# EAGLE design Damian_Edition (EAGLE 6.5.0)
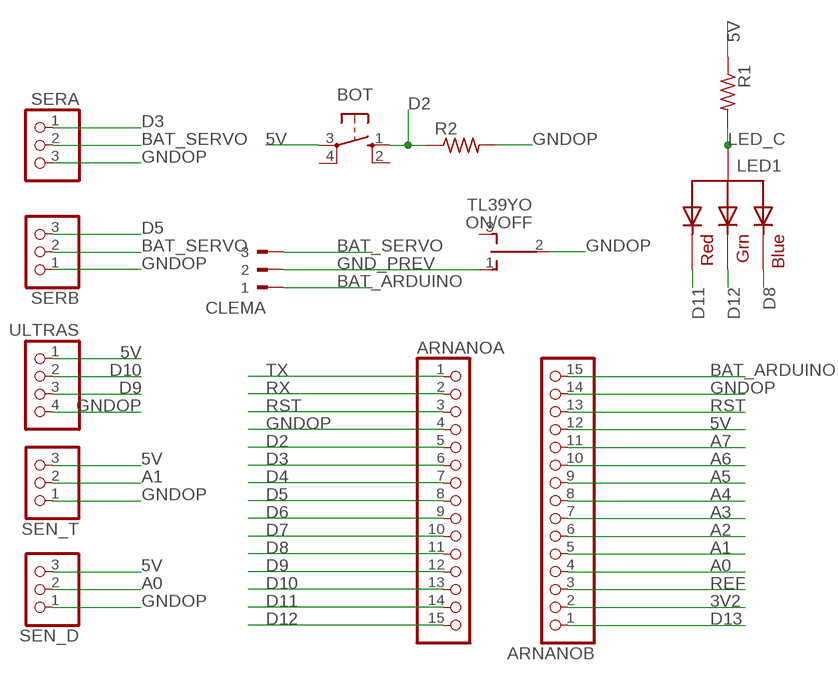
[diagram p0: schematic, sheet 1]

## Parts
ARNANOA  PINHD-1X15  [1X15]
ARNANOB  PINHD-1X15  [1X15]
BOT  10-XX  [B3F-10XX]
CLEMA  90-3  [90-3]
LED1  RGBLED_CA-5MM  [LED5MMRGB]
ON/OFF  TL39YO  [TL3XYO]
R1  R-US_0207/2V  [0207/2V]
R2  R-US_0207/2V  [0207/2V]
SEN_D  PINHD-1X3  [1X03]
SEN_T  PINHD-1X3  [1X03]
SERA  PINHD-1X3  [1X03]
SERB  PINHD-1X3  [1X03]
ULTRAS  PINHD-1X4  [1X04]

## Nets
3V2: ARNANOB.2
5V: ARNANOB.12 BOT.3(P) R1.1 SEN_D.3 SEN_T.3 ULTRAS.1
A0: ARNANOB.4 SEN_D.2
A1: ARNANOB.5 SEN_T.2
A2: ARNANOB.6
A3: ARNANOB.7
A4: ARNANOB.8
A5: ARNANOB.9
A6: ARNANOB.10
A7: ARNANOB.11
BAT_ARDUINO: ARNANOB.15 CLEMA.1
BAT_SERVO: CLEMA.3 SERA.2 SERB.2
D2: ARNANOA.5 BOT.1(S) R2.1
D3: ARNANOA.6 SERA.1
D4: ARNANOA.7
D5: ARNANOA.8 SERB.3
D6: ARNANOA.9
D7: ARNANOA.10
D8: ARNANOA.11 LED1.4(BLUE)
D9: ARNANOA.12 ULTRAS.3
D10: ARNANOA.13 ULTRAS.2
D11: ARNANOA.14 LED1.1(RED)
D12: ARNANOA.15 LED1.3(GREEN)
D13: ARNANOB.1
GND_PREV: CLEMA.2 ON/OFF.1(O)
GNDOP: ARNANOA.4 ARNANOB.14 ON/OFF.2(P) R2.2 SEN_D.1 SEN_T.1 SERA.3 SERB.1 ULTRAS.4
LED_C: LED1.2(VCC) R1.2
REF: ARNANOB.3
RST: ARNANOA.3 ARNANOB.13
RX: ARNANOA.2
TX: ARNANOA.1
Unconnected: BOT.2(S1) BOT.4(P1) ON/OFF.3(S)

## Library data of the parts
ARNANOA ARNANOB = pinhead:PINHD-1X15: PIN HEADER
BOT = switch-omron:10-XX: OMRON SWITCH; MPN: B3F-1000; OC_FARNELL: 176432; OC_NEWARK: 36M3542
CLEMA = con-weidmueller-sl35:90-3: WEIDMUELLER CLAMP CONNECTOR; OC_FARNELL: unknown; OC_NEWARK: unknown
LED1 = adafruit:RGBLED_CA: RGB LED, common-anode 5MM Staggered pins 5mm Piranha package http://www.ladyada.net/library/pcb/eaglelibrary.html
ON/OFF = switch:TL39YO: TINY SWITCH ON OFF ON Source: http://www2.produktinfo.conrad.com/datenblaetter/700000-724999/705152-da-01-de-Subminiaturschalter_TL_36YO.pdf
R1 R2 = adafruit:R-US_: RESISTOR, American symbol
SEN_D SEN_T SERA SERB = pinhead:PINHD-1X3: PIN HEADER
ULTRAS = pinhead:PINHD-1X4: PIN HEADER

## Board
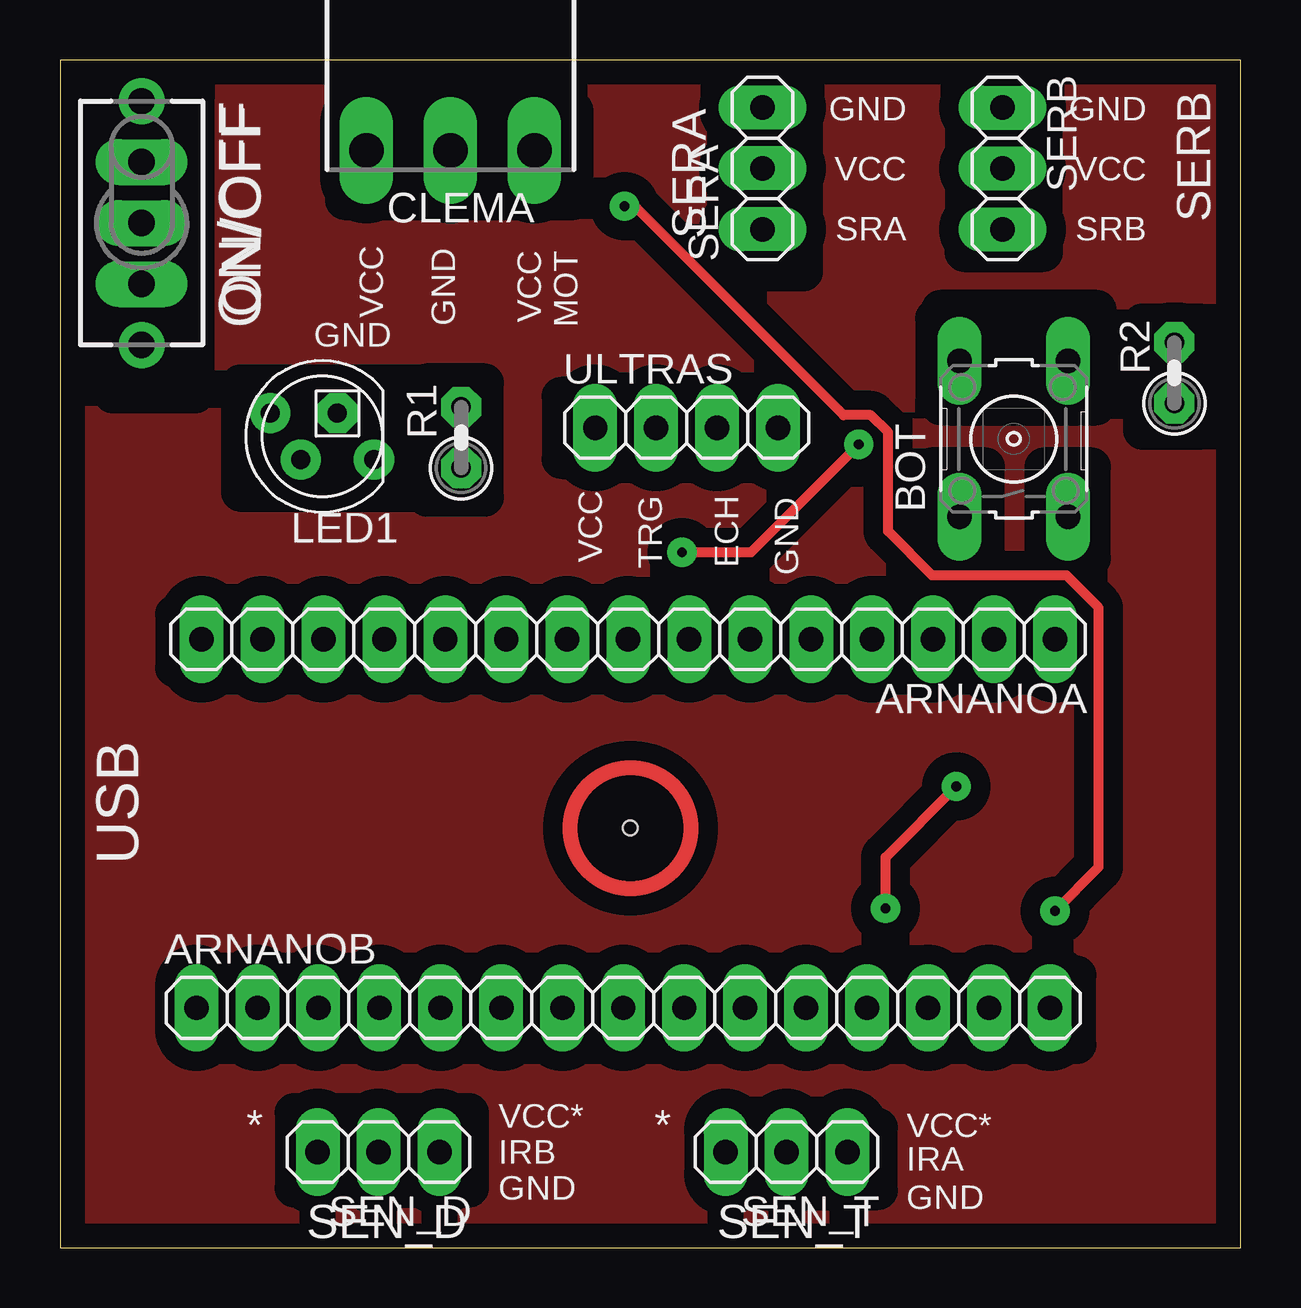
[diagram p1: board, top side]
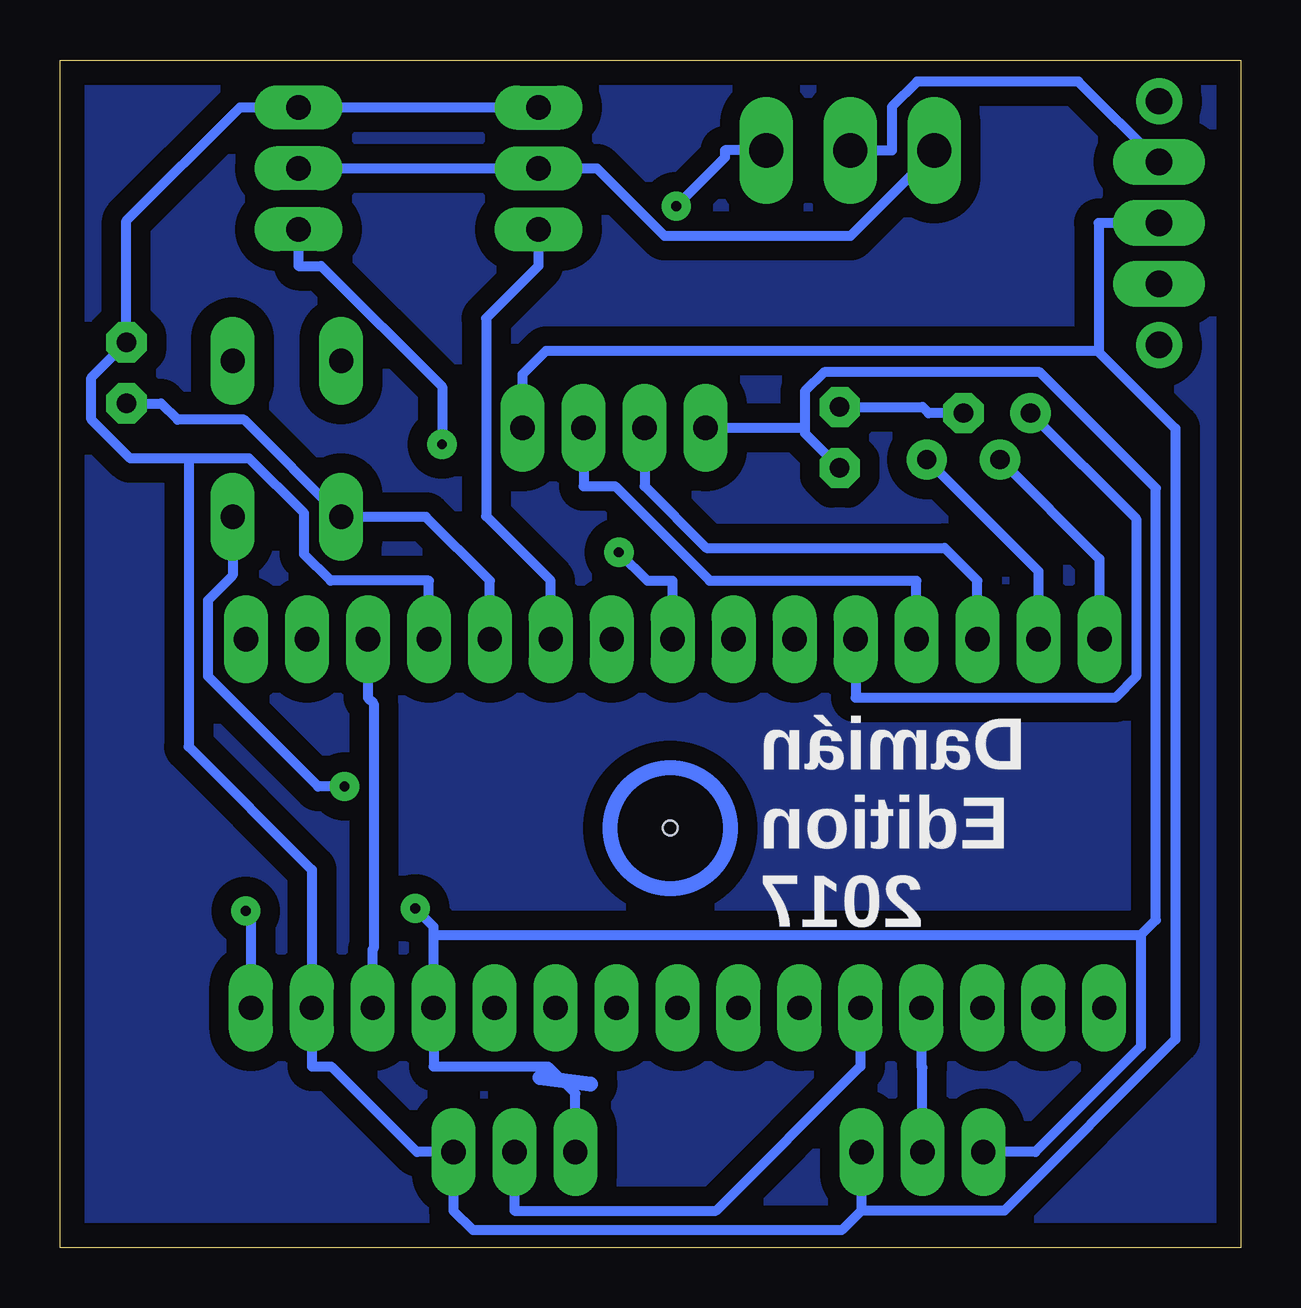
[diagram p2: board, bottom side, seen from below]

Size 49.2 x 49.52 mm. Coordinates in mm from the lower left corner, seen from the top.
Outline: 0,0 49.2,0 49.2,49.52 0,49.52 0,0
Copper layers (1*16): Top 0.035mm / dielectric 1.5mm / Bottom 0.035mm
Design rules "default *": minimum track width 16mil, minimum drill 16mil, track to track 16mil, track to pad 16mil, pad to pad 16mil, via to via 16mil, smd to smd 8mil, copper to edge 40mil, drill to drill 8mil, minimum pad ring 16mil, minimum via ring 16mil, stop-mask expansion 4mil, vias tented up to drill 0mil, thermal gap 10mil
Holes 0.61 mm at 23.77,17.5 23.77,17.5
tRestrict: area 4.8,24.2 to 42.6,26.4; area 5.1,8.5 to 42.4,11.4; area 9.8,2.5 to 17.1,5.6; area 27.2,2.4 to 34.1,5; area 20.9,32.9 to 31,35.5; area 36.6,29.3 to 38.2,32; area 41,28.8 to 43,32.6; area 36.7,35.1 to 43.2,38.6; area 36.3,29 to 38.6,32.6; area 37.7,41.5 to 41,48.9; area 27.8,40.7 to 31,48.1; area 13.3,43.7 to 21.4,47.4; 7 more areas

### Footprints (pad centres in the part's own frame; a part is rotated, then mirrored left to right if it is on the bottom)
1X15 = drill 1.016 long: 1 -17.78,0; 2 -15.24,0; 3 -12.7,0; 4 -10.16,0; 5 -7.62,0; 6 -5.08,0; 7 -2.54,0; 8 0,0; 9 2.54,0; 10 5.08,0; 11 7.62,0; 12 10.16,0; 13 12.7,0; 14 15.24,0; 15 17.78,0
B3F-10XX = drill 1.016 long: 1 -3.251,2.261; 2 3.251,2.261; 3 -3.251,-2.261; 4 3.251,-2.261
90-3 = drill 1.422 long: 1 -3.5,5.25; 2 0,5.25; 3 3.5,5.25
LED5MMRGB = drill 0.8 pad 1.676: 1 -2.159,0.968; 3 0.889,0.968; 4 2.159,-0.968 | drill 0.8 pad 1.676 octagon: 2 -0.635,-0.968
TL3XYO = drill 1.1 pad 1.422 long: 1 -2.54,0; 2 0,0; 3 2.54,0 | drill 1.1 pad 1.676: M1 -5.08,0; M2 5.08,0
0207/2V = drill 0.813 pad 1.676 octagon: 1 -1.27,0; 2 1.27,0
1X03 = drill 1.016 long: 1 -2.54,0; 2 0,0; 3 2.54,0
1X04 = drill 1.016 long: 1 -3.81,0; 2 -1.27,0; 3 1.27,0; 4 3.81,0

### Placement (x,y rotation side)
ARNANOA  23.67,25.37 180 top
ARNANOB  23.47,10.01 0 top
BOT  39.74,33.73 90 top
CLEMA  16.27,51 180 top
LED1  10.92,33.83 180 top
ON/OFF  3.4,42.72 270 top
R1  16.71,33.78 90 top
R2  46.43,36.47 90 top
SEN_D  13.27,4 180 top
SEN_T  30.27,4 180 top
SERA  29.27,45 90 top
SERB  39.27,45 270 top
ULTRAS  26.11,34.19 0 top

### Tracks (layer width: path | path; a pad name or v marks a point on that pad's centre or on a via)
5V  (via drill 0.41 pad 1.22)
  Top 0.406: v34.4,14.15 34.4,16.29 v37.35,19.24
  Bottom 0.406: 4.16,13.05 3.54,13.67 3.54,31.68 8.37,36.5 17.36,36.5 18.16,35.71 18.16,34.19 | 33.63,13.05 4.16,13.05 | 4.16,13.05 4.16,8.4 8.56,4 SEN_D.3 | 33.63,13.05 33.63,13.38 v34.4,14.15 | 33.63,13.05 33.63,12.45 ARNANOB.12 33.63,7.57 28.86,7.57 27.73,6.44 SEN_T.3 | 18.16,34.19 18.16,33.96 R1.1 | ULTRAS.1 18.16,34.19 | BOT.3 42,28.04 43.03,27.01 43.03,23.82 38.44,19.24 v37.35,19.24
A0
  Bottom 0.406: ARNANOB.4 13.31,7.57 13.27,7.53 SEN_D.2
A1
  Bottom 0.406: ARNANOB.5 15.85,7.57 21.86,1.56 30.27,1.56 SEN_T.2
BAT_ARDUINO  (via drill 0.41 pad 1.22)
  Top 0.406: v41.46,14.06 43.28,15.87 43.28,26.7 41.94,28.04 36.34,28.04 34.5,29.88 34.5,34 33.79,34.71 32.65,34.71 23.94,43.42 v23.52,43.42
  Bottom 0.406: CLEMA.1 21.5,45.75 21.5,45.45 v23.52,43.42 | v41.46,14.06 41.25,13.85 ARNANOB.15
BAT_SERVO
  Bottom 0.406: CLEMA.3 12.77,45.67 16.25,42.19 24.02,42.19 26.83,45 SERA.2 SERB.2
D2
  Bottom 0.406: R2.1 44.98,35.2 44.3,34.52 41.53,34.52 BOT.1 33.95,30.47 31.29,27.81 ARNANOA.5
D3
  Bottom 0.406: ARNANOA.6 28.75,27.81 31.45,30.51 31.45,38.76 29.27,40.94 SERA.1
D5  (via drill 0.41 pad 1.22)
  Top 0.406: v33.28,33.49 28.78,29 v25.91,29
  Bottom 0.406: ARNANOA.8 23.67,27.81 24.73,27.81 v25.91,29 | SERB.3 39.27,40.94 38.32,40.94 33.28,35.9 v33.28,33.49
D8
  Bottom 0.406: ARNANOA.11 16.05,22.94 5.24,22.94 4.36,23.82 4.36,30.4 LED1.4
D9
  Bottom 0.406: ARNANOA.12 13.51,27.81 22.13,27.81 26.07,31.75 27.38,31.75 ULTRAS.3
D10
  Bottom 0.406: ARNANOA.13 10.97,27.81 12.34,29.18 22.27,29.18 24.84,31.75 ULTRAS.2
D11
  Bottom 0.406: LED1.1 8.43,28.22 ARNANOA.14
D12
  Bottom 0.406: LED1.3 5.89,28.72 ARNANOA.15
GND_PREV
  Bottom 0.406: CLEMA.2 14.54,45.75 14.54,47.56 13.48,48.62 6.76,48.62 ON/OFF.1
GNDOP
  Bottom 0.406: 43.84,32.91 46.27,32.91 47.9,34.54 47.9,36.28 R2.2 46.43,42.82 41.71,47.54 SERB.1 SERA.3 | 15.81,1.56 16.63,0.74 31.99,0.74 32.81,1.56 SEN_T.1 33.31,4 | 5.96,37.39 2.73,34.16 2.73,8.69 9.85,1.56 15.81,1.56 | ON/OFF.2 5.93,42.72 5.93,37.42 5.96,37.39 | 5.96,37.39 28.96,37.39 29.92,36.42 ULTRAS.4 | SEN_D.1 15.81,1.56 | 33.31,4 34.33,4 37.9,7.57 38.71,7.57 ARNANOB.14 38.71,15.77 43.84,20.9 43.84,32.91 | 33.31,4 | 43.84,32.91 41.32,32.91 39.03,30.62 39.03,28.91 37.93,27.81 33.83,27.81 ARNANOA.4
LED_C
  Bottom 0.406: LED1.2 13.01,34.8 13.26,35.05 R1.2
N$3
  pour Bottom (isolate 0.813): 0.27,49 0.27,0 48.77,0 48.77,49
N$4
  pour Top (isolate 0.813): -0.23,50 -0.23,0 48.77,0 48.77,50
N$5
  Bottom 0.635: 29.21,7.11 27.1,6.84 | 29.21,7.11 27.1,6.84 | 29.21,7.11 27.1,6.84 | 29.21,7.11 27.1,6.84 | 29.21,7.11 27.1,6.84 | 29.21,7.11 27.1,6.84 | 29.21,7.11 27.1,6.84 | 29.21,7.11 27.1,6.84 | 29.21,7.11 27.1,6.84 | 29.21,7.11 27.1,6.84 | 29.21,7.11 27.1,6.84
RST
  Bottom 0.406: ARNANOB.13 36.17,12.45 36.13,12.49 36.13,22.69 36.37,22.94 ARNANOA.3
(copper drawn outside any net)
  shapes: Bottom circle x3, Top circle x1

### Text on the board
_tsilk: GND | GND | VCC | VCC | SRA | SRB | SERB | VCC | GND | VCC / MOT | SERA | ON/OFF | GND | VCC | TRG | ECH | GND | USB | VCC* | VCC* | * | IRB | * | IRA | GND | GND | SEN_D | SEN_T
_bsilk: Damián / Edition / 2017